# EasyEDA Pro project Debugging_board.eprj

# Schematic Schematic1

## Sheets
1 MC: Board Name: Board1; Create Date: 2026-05-04; Page Name: MC; Project Name: Debugging_board; Schematic Name: Schematic1; Update Date: 2026-06-05; Company: EasyEDA.com; Page Size: A4; Version: V1.0
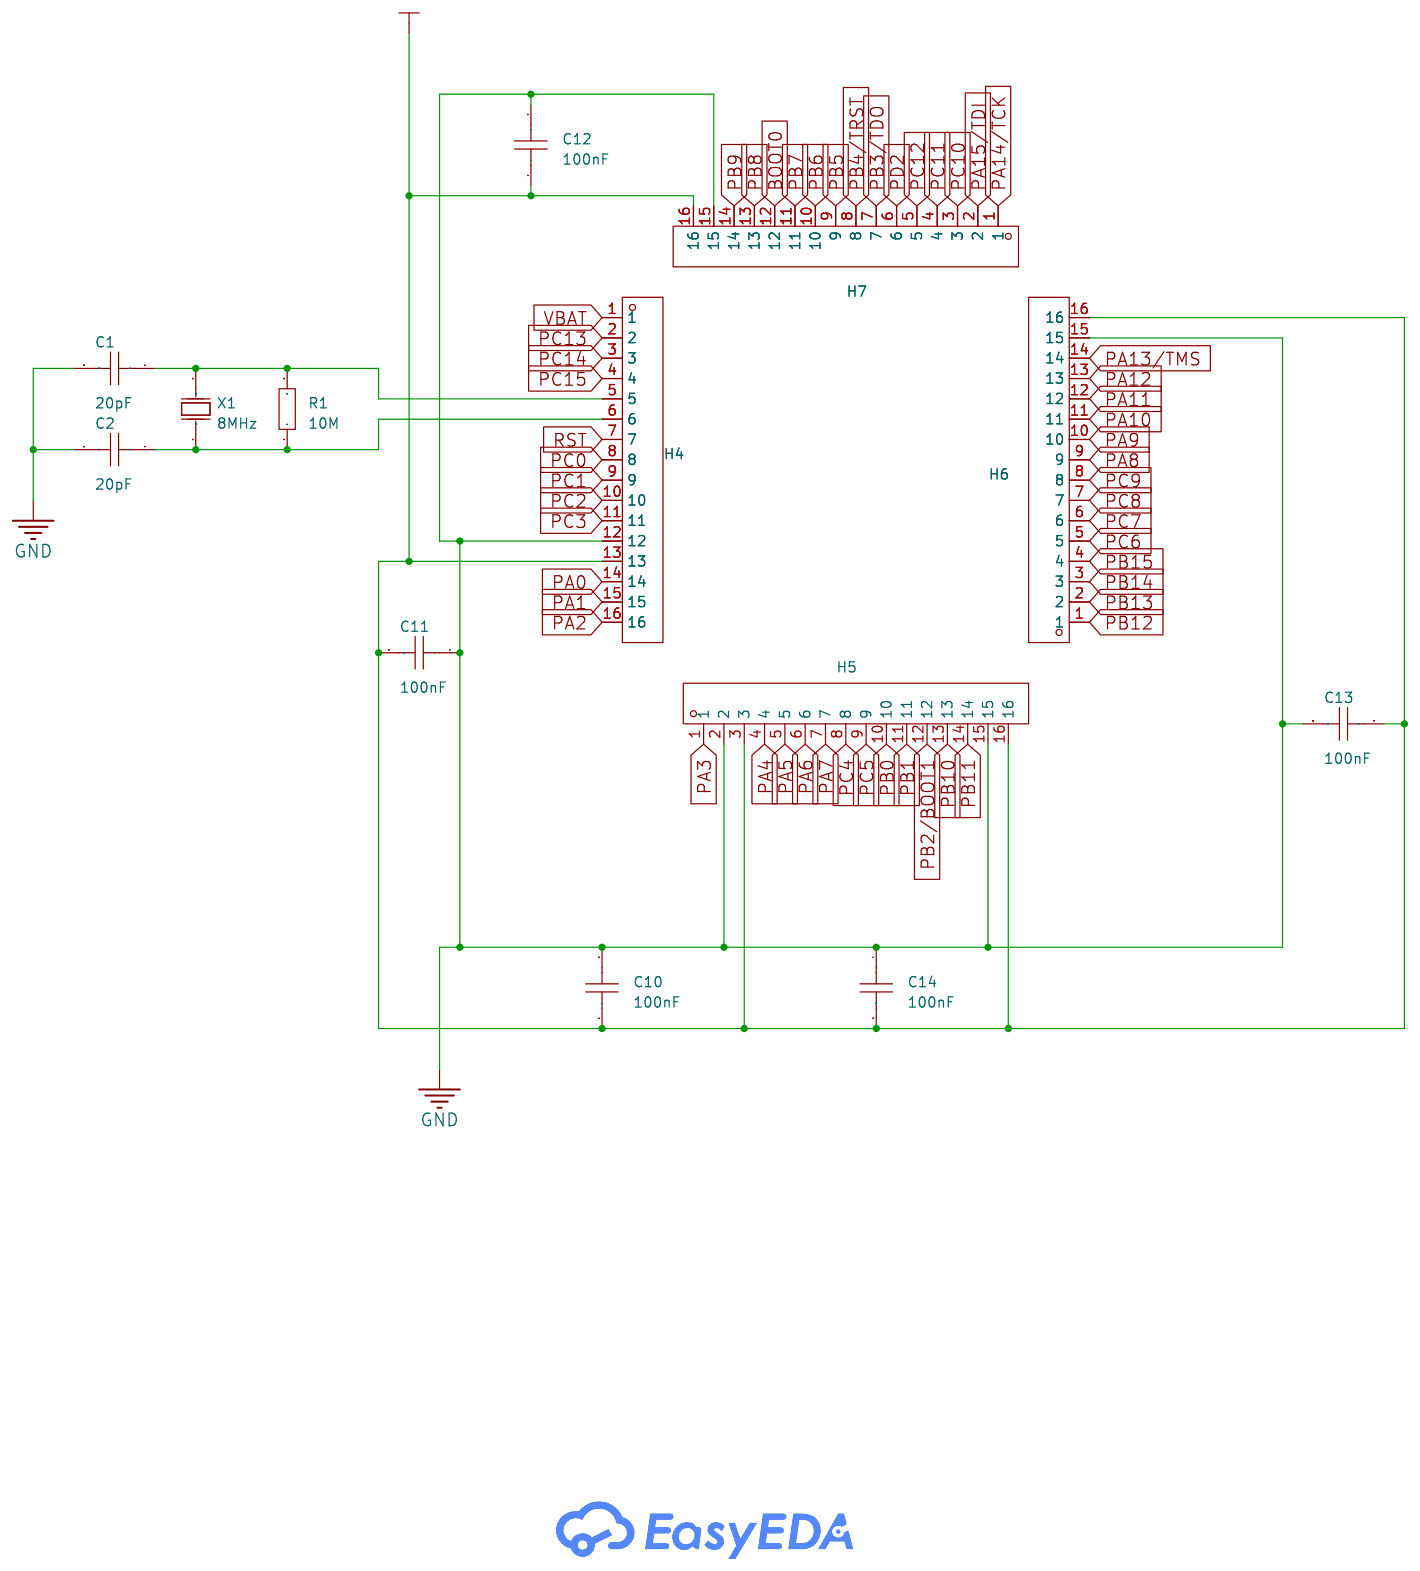
[diagram p0: MC]
2 Power: Page Name: Power; Update Date: 2026-05-11
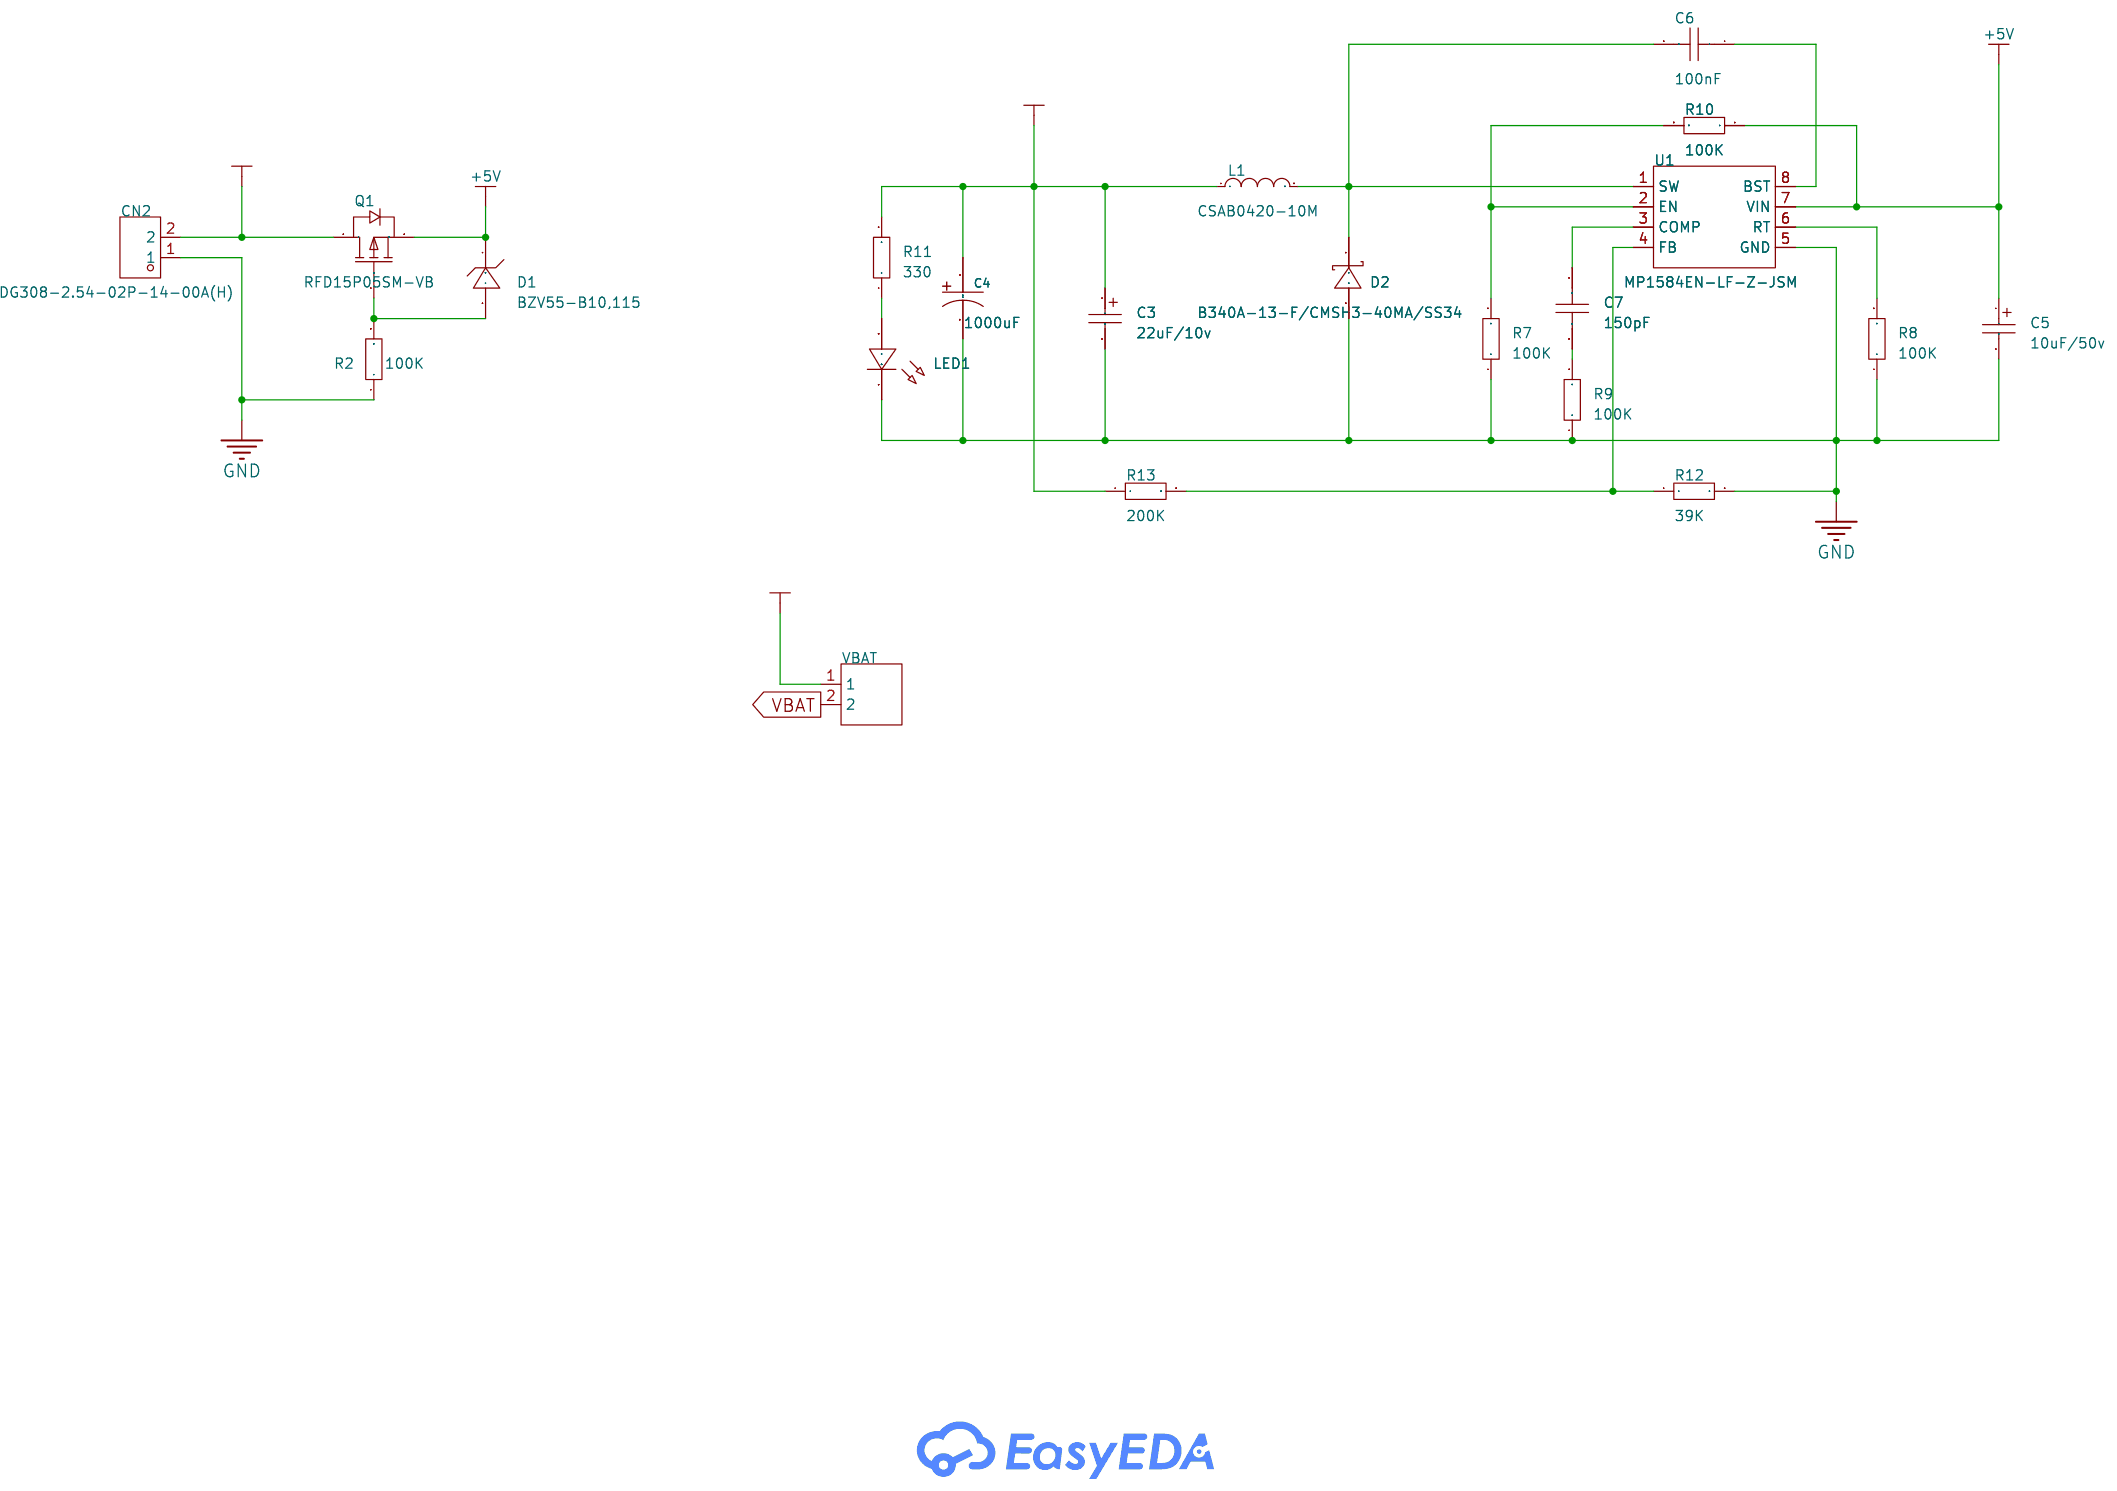
[diagram p1: Power]
3 JTAG/SWD: Page Name: JTAG/SWD; Update Date: 2026-05-11
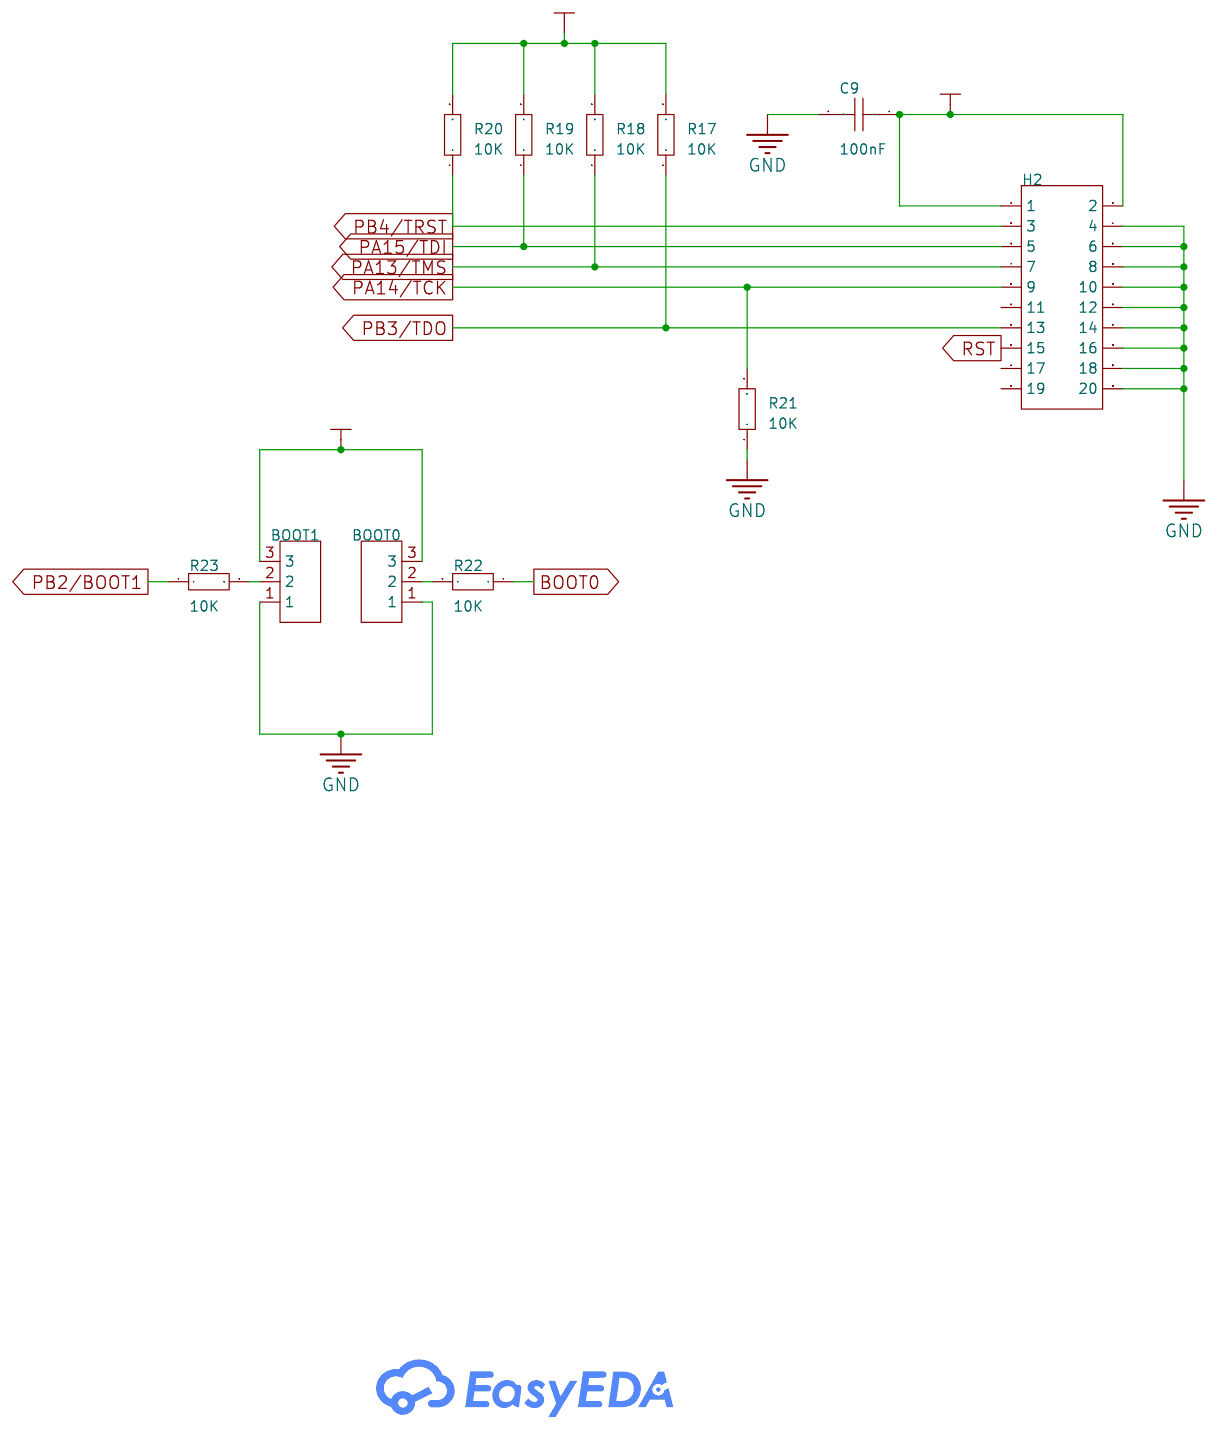
[diagram p2: JTAG/SWD]
4 USB/UART: Page Name: USB/UART; Update Date: 2026-06-09
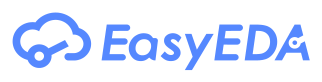
[diagram p3: USB/UART]
5 IN/OUT_Pins: Create Date: 2026-05-11; Page Name: P5
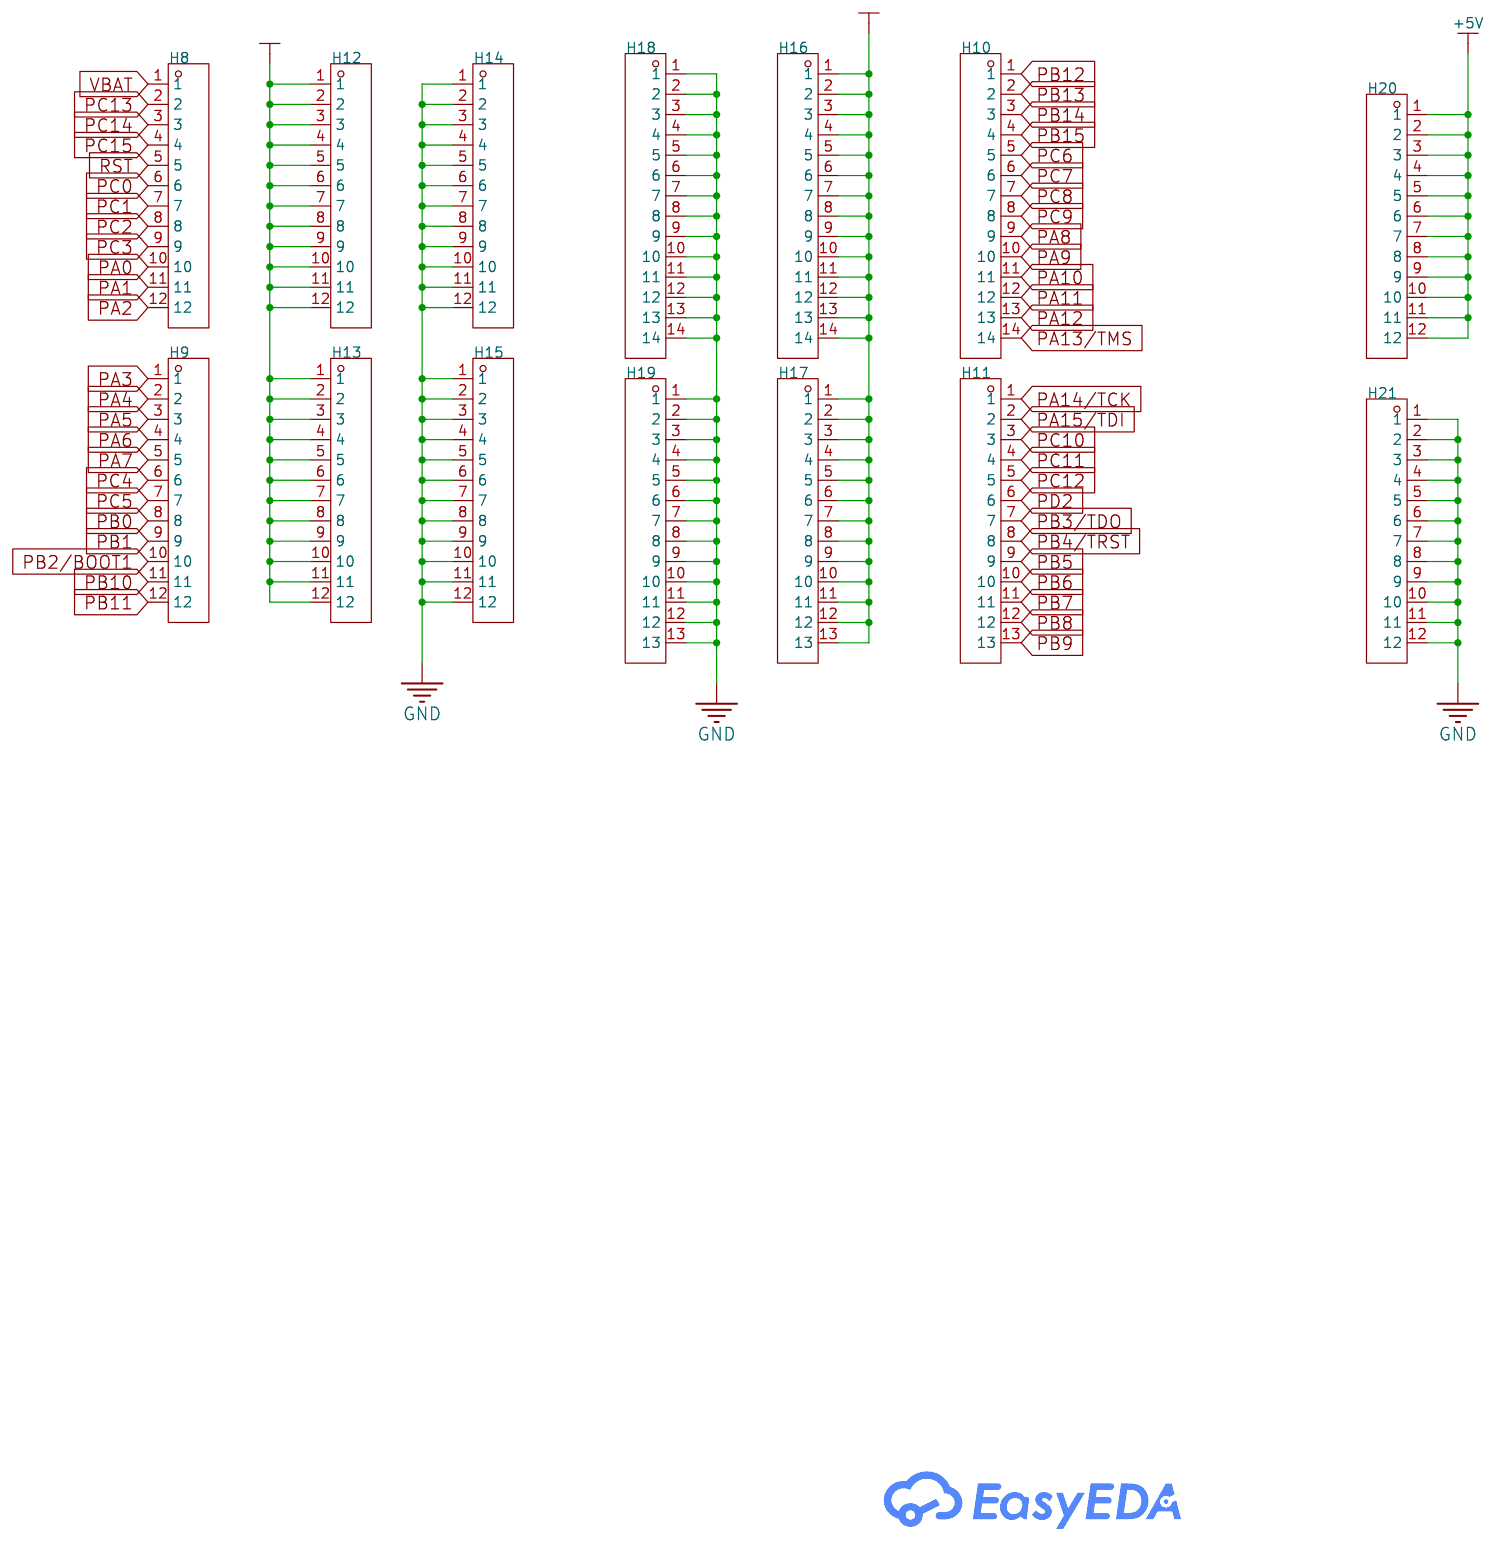
[diagram p4: IN/OUT_Pins]

## Parts
sheet IN/OUT_Pins
H8  -  [HDR-TH_12P-P2.54-V-M]
H9  -  [HDR-TH_12P-P2.54-V-M]
H10  -  [HDR-TH_14P-P2.54-V-M]
H11  -  [HDR-TH_13P-P2.54-V-M]
H12  -  [HDR-TH_12P-P2.54-V-M]
H13  -  [HDR-TH_12P-P2.54-V-M]
H14  -  [HDR-TH_12P-P2.54-V-M]
H15  -  [HDR-TH_12P-P2.54-V-M]
H16  -  [HDR-TH_14P-P2.54-V-M]
H17  -  [HDR-TH_13P-P2.54-V-M]
H18  -  [HDR-TH_14P-P2.54-V-M]
H19  -  [HDR-TH_13P-P2.54-V-M]
H20  -  [HDR-TH_12P-P2.54-V-M]
H21  -  [HDR-TH_12P-P2.54-V-M]
sheet JTAG/SWD
BOOT0  -  [HDR-TH_3P-P2.54-V-M]
BOOT1  -  [HDR-TH_3P-P2.54-V-M]
C9  100nF  [C0603]
H2  -  [HDR-TH_20P-P2.54-V-R2-C10-S2.54]
R17  10K  [R0603]
R18  10K  [R0603]
R19  10K  [R0603]
R20  10K  [R0603]
R21  10K  [R0603]
R22  10K  [R0603]
R23  10K  [R0603]
sheet MC
C1  20pF  [C0603]
C2  20pF  [C0603]
C10  100nF  [C0603]
C11  100nF  [C0603]
C12  100nF  [C0603]
C13  100nF  [C0603]
C14  100nF  [C0603]
H4  -  [HDR-TH_16P-P2.54-V-M]
H5  -  [HDR-TH_16P-P2.54-V-M]
H6  -  [HDR-TH_16P-P2.54-V-M]
H7  -  [HDR-TH_16P-P2.54-V-M]
R1  10M  [R0603]
X1  8MHz  [HC-49S_L11.4-W4.8]
sheet Power
C3  22uF/10v  [CAP-SMD_L7.3-W4.3-R-RD]
C4  1000uF  [CAP-SMD_BD10.0-L10.3-W10.3-LS11.0-FD]
C5  10uF/50v  [CAP-SMD_L7.3-W4.3-R-RD]
C6  100nF  [C0603]
C7  150pF  [C0603]
CN2  DG308-2.54-02P-14-00A(H)  [CONN-TH_DG308-2.54-02P-14-00A]
D1  BZV55-B10,115  [SOD-80C_L3.3-W1.5-RD]
D2  B340A-13-F/CMSH3-40MA/SS34  [SMA_L4.4-W2.6-LS5.0-RD]
L1  CSAB0420-10M  [IND-SMD_L4.4-W4.2]
LED1  -  [LED0805-RD_GREEN]
Q1  RFD15P05SM-VB  [TO-252-2_L6.6-W6.1-P4.58-LS9.9-TL]
R2  100K  [R0603]
R7  100K  [R0603]
R8  100K  [R0603]
R9  100K  [R0603]
R10  100K  [R0603]
R11  330  [R0603]
R12  39K  [R0603]
R13  200K  [R0603]
U1  MP1584EN-LF-Z-JSM  [SOP-8_L4.9-W3.9-P1.27-LS6.0-BL_1]
VBAT  -  [HDR-TH_2P-P2.54-V-M-1]

## Library data of the parts
H8 H9 H12-H15 H20 H21 = HDR-M_2.54_1x12P: Supplier Footprint: Through
H10 H16 H18 = HDR-M_2.54_1x14P: Supplier Footprint: Through
H11 H17 H19 = HDR-M_2.54_1x13P: Supplier Footprint: Through
BOOT0 BOOT1 = HDR-M_2.54_1x3P: Supplier Footprint: Through
C1 C2 C6 C7 C9-C14 = CAP_0603: Supplier Footprint: 0603
H2 = HDR-F_2.54_2x10: Supplier Footprint: Through
R1 R2 R7-R13 R17-R23 = Res_0603: Supplier Footprint: 0603
H4-H7 = HDR-M_2.54_1x16P: Supplier Footprint: Through
X1 = X49SM8MSD2SI: LCSC Part Name: HC-49SMD 8MHZ 20PF ±20PPM -40~85℃ (±30PPM); Supplier Part: C106809; Manufacturer: YXC(扬兴晶振); Supplier Footprint: HC-49S-SMD; JLCPCB Part Class: Extended Part; Datasheet: https://item.szlcsc.com/datasheet/X49SM8MSD2SI/108025.html; Supplier: LCSC; Type: Crystal Oscillator; Normal temperature Frequency Tolerance: ±20ppm; Load Capacitance: 20pF; Frequency Stability: ±30ppm; Equivalent Series Resistance(ESR): 60Ω; Operating Temperature: -40℃~+85℃
C3 C5 = T491D106K050AT: Capacitance:10uF Tolerance:±10% Tolerance:±10% Voltage Rating:50V Equivalent Series Resistance(ESR):800mΩ@100kHz Operating Temperature:-55℃~+125℃ Operating Temperature:-55℃~+125℃; LCSC Part Name: 10uF ±10% 50V; Supplier Part: C117038; Manufacturer: KEMET(基美); Supplier Footprint: CASE-D-7343; JLCPCB Part Class: Extended Part; Datasheet: https://item.szlcsc.com/datasheet/T491D106K050AT/118296.html; Supplier: LCSC; Tolerance: ±10%; Voltage Rating: 50V; Equivalent Series Resistance(ESR): 800mΩ@100kHz; Operating Temperature: -55℃~+125℃
C4 = VT1C102MG105000CE0: Capacitance:1000uF Tolerance:±20% Tolerance:±20% Voltage Rating:16V Ripple Current:- Equivalent Series Resistance(ESR):- Diameter:10mm Height - Seated (Max):10.5mm Lifetime:1000hrs@105℃ Operating Temperature:-40℃~+105℃ Operating Temperature:-40℃~+105℃; LCSC Part Name: 1000uF ±20% 16V; Supplier Part: C189257; Manufacturer: HUAWEI(华威集团); Supplier Footprint: SMD,D10xL10.5mm; JLCPCB Part Class: Extended Part; Datasheet: https://item.szlcsc.com/datasheet/VT1C102MG105000CE0/200665.html; Supplier: LCSC; Tolerance: ±20%; Voltage Rating: 16V; Diameter: 10mm; Height - Seated (Max): 10.5mm; Lifetime: 1000hrs@105℃; Operating Temperature: -40℃~+105℃
CN2 = DG308-2.54-02P-14-00A(H): Number of Positions or Pins:1x2P Pitch:2.54mm Color:Green Mounting Type:Through Hole Number of Pins:2P Number of Rows:1 Number of PINs Per Row:2 Current Rating:8A Voltage Rating (Max):130V Wire Gauge - AWG:18~26 Wire Gauge - mm2:0.5~1 Wire Gauge - mm2:0.5; LCSC Part Name: 1x2P 2.54mm 直插 排数:1 每排P数:2; Supplier Part: C699496; Manufacturer: DEGSON(高正/高松); Supplier Footprint: 插件,P=2.54mm; JLCPCB Part Class: Extended Part; Datasheet: https://item.szlcsc.com/datasheet/DG308-2.54-02P-14-00A(H)/734134.html; Supplier: LCSC; Number of Positions or Pins: 1x2P; Pitch: 2.54mm; Color: Green; Mounting Type: Through Hole; Number of Pins: 2P; Number of Rows: 1; Number of PINs Per Row: 2; Current Rating: 8A; Voltage Rating (Max): 130V; Wire Gauge - AWG: 18~26; Wire Gauge - mm2: 0.5~1; Operating Temperature: -40℃~+105℃
D1 = BZV55-B10,115: Diode Configuration:Independent Zener Voltage(Nom):10V Reverse Leakage Current (Ir):200nA@7V Zener Voltage(Range):9.8V~10.2V Zener Voltage(Range):9.8V~10.2V Pd - Power Dissipation:400mW Impedance(Zzt):20Ω Operating Junction Temperature Range:-65℃~+200℃ Op; LCSC Part Name: 稳压二极管; Supplier Part: C426806; Manufacturer: Nexperia(安世); Supplier Footprint: SOD-80C; JLCPCB Part Class: Extended Part; Datasheet: https://item.szlcsc.com/datasheet/BZV55-B10%252C115/420825.html; Supplier: LCSC; Diode Configuration: Independent; Zener Voltage(Nom): 10V; Reverse Leakage Current (Ir): 200nA@7V; Zener Voltage(Range): 9.8V~10.2V; Pd - Power Dissipation: 400mW; Impedance(Zzt): 20Ω; Operating Junction Temperature Range: -65℃~+200℃
D2 = B340A-13-F: Voltage - Forward(Vf@If):500mV@3A Voltage - DC Reverse(Vr):40V Current - Rectified:3A Reverse Leakage Current (Ir):500uA@40V Operating Junction Temperature Range:-55℃~+150℃ Operating Junction Temperature Range:-55℃~+150℃ Non-Repetitive Peak Forward Surge; LCSC Part Name: 电压:40V 电流:3A; Supplier Part: C85098; Manufacturer: DIODES(美台); Supplier Footprint: SMA(DO-214AC); JLCPCB Part Class: Extended Part; Datasheet: https://item.szlcsc.com/datasheet/B340A-13-F/86270.html; Supplier: LCSC; Voltage - Forward(Vf@If): 500mV@3A; Voltage - DC Reverse(Vr): 40V; Current - Rectified: 3A; Reverse Leakage Current (Ir): 500uA@40V; Operating Junction Temperature Range: -55℃~+150℃; Non-Repetitive Peak Forward Surge Current: 80A
L1 = CSAB0420-100M: Supplier Part: C5125935; Manufacturer: CODACA(科达嘉); JLCPCB Part Class: Extended Part; Datasheet: https://atta.szlcsc.com/upload/public/pdf/source/20230606/07D625B4CCEFD7B1946E8EEA1A450EE5.pdf; Supplier: LCSC
LED1 = LED_0805-B: Supplier Footprint: 0805
Q1 = RFD15P05SM-VB: Number:1 P-Channel Drain to Source Voltage:60V Current - Continuous Drain(Id):30A RDS(on):61mΩ@10V；72mΩ@4.5V Pd - Power Dissipation:- Gate Threshold Voltage (Vgs(th)):2V@250uA Gate Charge(Qg):10nC@10V Input Capacitance(Ciss):1nF Reverse Transfer Capacitan; LCSC Part Name: 1个P沟道 耐压:60V 电流:30A; Supplier Part: C710052; Manufacturer: VBsemi(微碧半导体); Supplier Footprint: TO-252; JLCPCB Part Class: Extended Part; Datasheet: https://item.szlcsc.com/datasheet/RFD15P05SM-VB/748010.html; Supplier: LCSC; Number: 1 P-Channel; Drain to Source Voltage: 60V; Current - Continuous Drain(Id): 30A; RDS(on): 61mΩ@10V；72mΩ@4.5V; Gate Threshold Voltage (Vgs(th)): 2V@250uA; Gate Charge(Qg): 10nC@10V; Input Capacitance(Ciss): 1nF; Reverse Transfer Capacitance (Crss@Vds): 100pF; Operating Temperature: -55℃~+175℃; Type: P-Channel; Output Capacitance(Coss): 120pF
U1 = MP1584EN-LF-Z-JSM: Supplier Part: C49367328; Manufacturer: JSMSEMI(杰盛微); JLCPCB Part Class: Extended Part; Datasheet: https://item.szlcsc.com/datasheet/MP1584EN-LF-Z-JSM/51875040.html; Supplier: LCSC
VBAT = HDR-M_2.54_1x2P: Supplier Footprint: Through

## Nets
+3V3: BOOT0.3 BOOT1.3 C3.1 C4.1 C9.1 C10.1 C11.2 C12.1 C13.1 C14.2 H2.1 H2.2 H4.13 H5.3 H5.16 H6.16 H7.16 H12.1 H12.2 H12.3 H12.4 H12.5 H12.6 H12.7 H12.8 H12.9 H12.10 H12.11 H12.12 H13.1 H13.2 H13.3 H13.4 H13.5 H13.6 H13.7 H13.8 H13.9 H13.10 H13.11 H13.12 H16.1 H16.2 H16.3 H16.4 H16.5 H16.6 H16.7 H16.8 H16.9 H16.10 H16.11 H16.12 H16.13 H16.14 H17.1 H17.2 H17.3 H17.4 H17.5 H17.6 H17.7 H17.8 H17.9 H17.10 H17.11 H17.12 H17.13 L1.1 R11.2 R13.1 R17.2 R18.2 R19.2 R20.2 VBAT.1
+5V: C5.1 D1.1(C) H20.1 H20.2 H20.3 H20.4 H20.5 H20.6 H20.7 H20.8 H20.9 H20.10 H20.11 H20.12 Q1.3(S) R10.1 U1.7(VIN)
+12V: CN2.2 Q1.2(D)
GND: BOOT0.1 BOOT1.1 C1.2 C2.2 C3.2 C4.2 C5.2 C9.2 C10.2 C11.1 C12.2 C13.2 C14.1 CN2.1 D2.2(A) H2.4 H2.6 H2.8 H2.10 H2.12 H2.14 H2.16 H2.18 H2.20 H4.12 H5.2 H5.15 H6.15 H7.15 H14.1 H14.2 H14.3 H14.4 H14.5 H14.6 H14.7 H14.8 H14.9 H14.10 H14.11 H14.12 H15.1 H15.2 H15.3 H15.4 H15.5 H15.6 H15.7 H15.8 H15.9 H15.10 H15.11 H15.12 H18.1 H18.2 H18.3 H18.4 H18.5 H18.6 H18.7 H18.8 H18.9 H18.10 H18.11 H18.12 H18.13 H18.14 H19.1 H19.2 H19.3 H19.4 H19.5 H19.6 H19.7 H19.8 H19.9 H19.10 H19.11 H19.12 H19.13 H21.1 H21.2 H21.3 H21.4 H21.5 H21.6 H21.7 H21.8 H21.9 H21.10 H21.11 H21.12 LED1.1(C) R2.1 R7.1 R8.1 R9.1 R12.2 R21.1 U1.5(GND)
VBAT: H4.1 H8.1 VBAT.2
BOOT0: H7.12 R22.1
PA0: H4.14 H8.10
PA1: H4.15 H8.11
PA2: H4.16 H8.12
PA3: H5.1 H9.1
PA4: H5.4 H9.2
PA5: H5.5 H9.3
PA6: H5.6 H9.4
PA7: H5.7 H9.5
PA8: H6.9 H10.9
PA9: H6.10 H10.10
PA10: H6.11 H10.11
PA11: H6.12 H10.12
PA12: H6.13 H10.13
PA13/TMS: H2.7 H6.14 H10.14 R18.1
PA14/TCK: H2.9 H7.1 H11.1 R21.2
PA15/TDI: H2.5 H7.2 H11.2 R19.1
PB0: H5.10 H9.8
PB1: H5.11 H9.9
PB2/BOOT1: H5.12 H9.10 R23.1
PB3/TDO: H2.13 H7.7 H11.7 R17.1
PB4/TRST: H2.3 H7.8 H11.8 R20.1
PB5: H7.9 H11.9
PB6: H7.10 H11.10
PB7: H7.11 H11.11
PB8: H7.13 H11.12
PB9: H7.14 H11.13
PB10: H5.13 H9.11
PB11: H5.14 H9.12
PB12: H6.1 H10.1
PB13: H6.2 H10.2
PB14: H6.3 H10.3
PB15: H6.4 H10.4
PC0: H4.8 H8.6
PC1: H4.9 H8.7
PC2: H4.10 H8.8
PC3: H4.11 H8.9
PC4: H5.8 H9.6
PC5: H5.9 H9.7
PC6: H6.5 H10.5
PC7: H6.6 H10.6
PC8: H6.7 H10.7
PC9: H6.8 H10.8
PC10: H7.3 H11.3
PC11: H7.4 H11.4
PC12: H7.5 H11.5
PC13: H4.2 H8.2
PC14: H4.3 H8.3
PC15: H4.4 H8.4
PD2: H7.6 H11.6
RST: H2.15 H4.7 H8.5
$1N1019: C1.1 H4.5 R1.2 X1.2(OSC2)
$1N1024: C2.1 H4.6 R1.1 X1.1(OSC1)
$2N251: D1.2(A) Q1.1(G) R2.2
$2N756: C6.2 D2.1(K) L1.2 U1.1(SW)
$2N758: R7.2 R10.2 U1.2(EN)
$2N759: R8.2 U1.6(RT)
$2N760: C7.1 U1.3(COMP)
$2N761: C7.2 R9.2
$2N764: LED1.2(A) R11.1
$2N765: R12.1 R13.2 U1.4(FB)
$2N766: C6.1 U1.8(BST)
$3N561: BOOT0.2 R22.2
$3N565: BOOT1.2 R23.2

Not connected (* = marked no-connect by the designer): H2 11 17 19

# Board PCB1
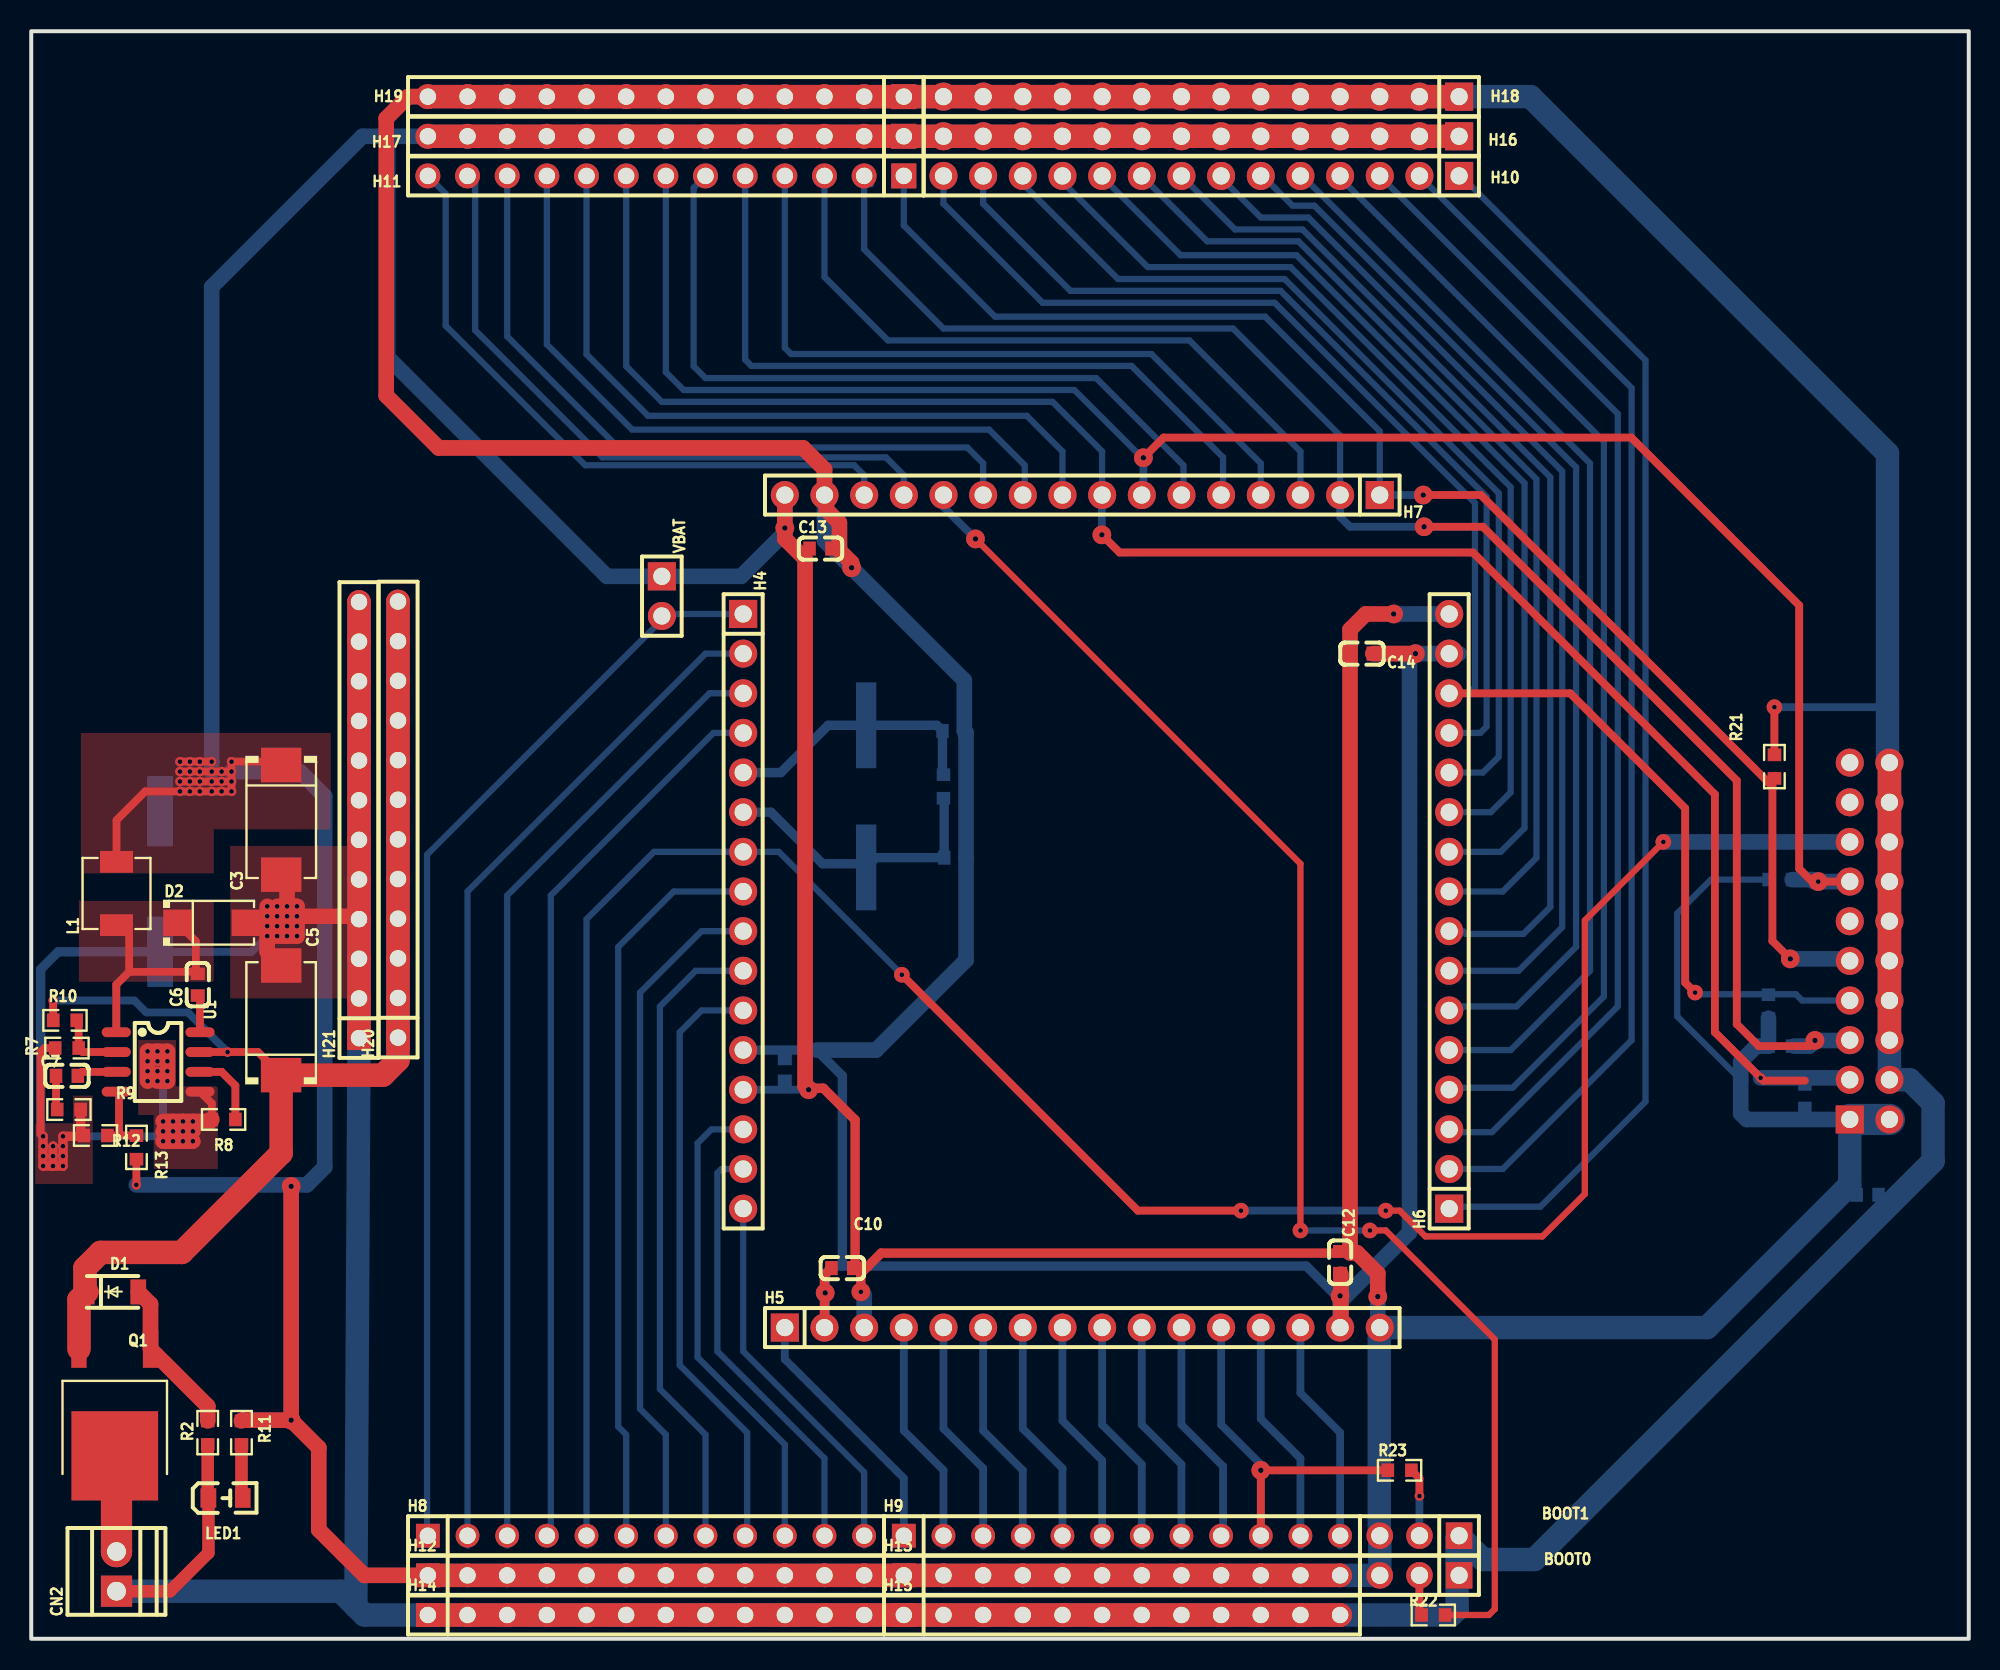
[diagram p5: board, top side]
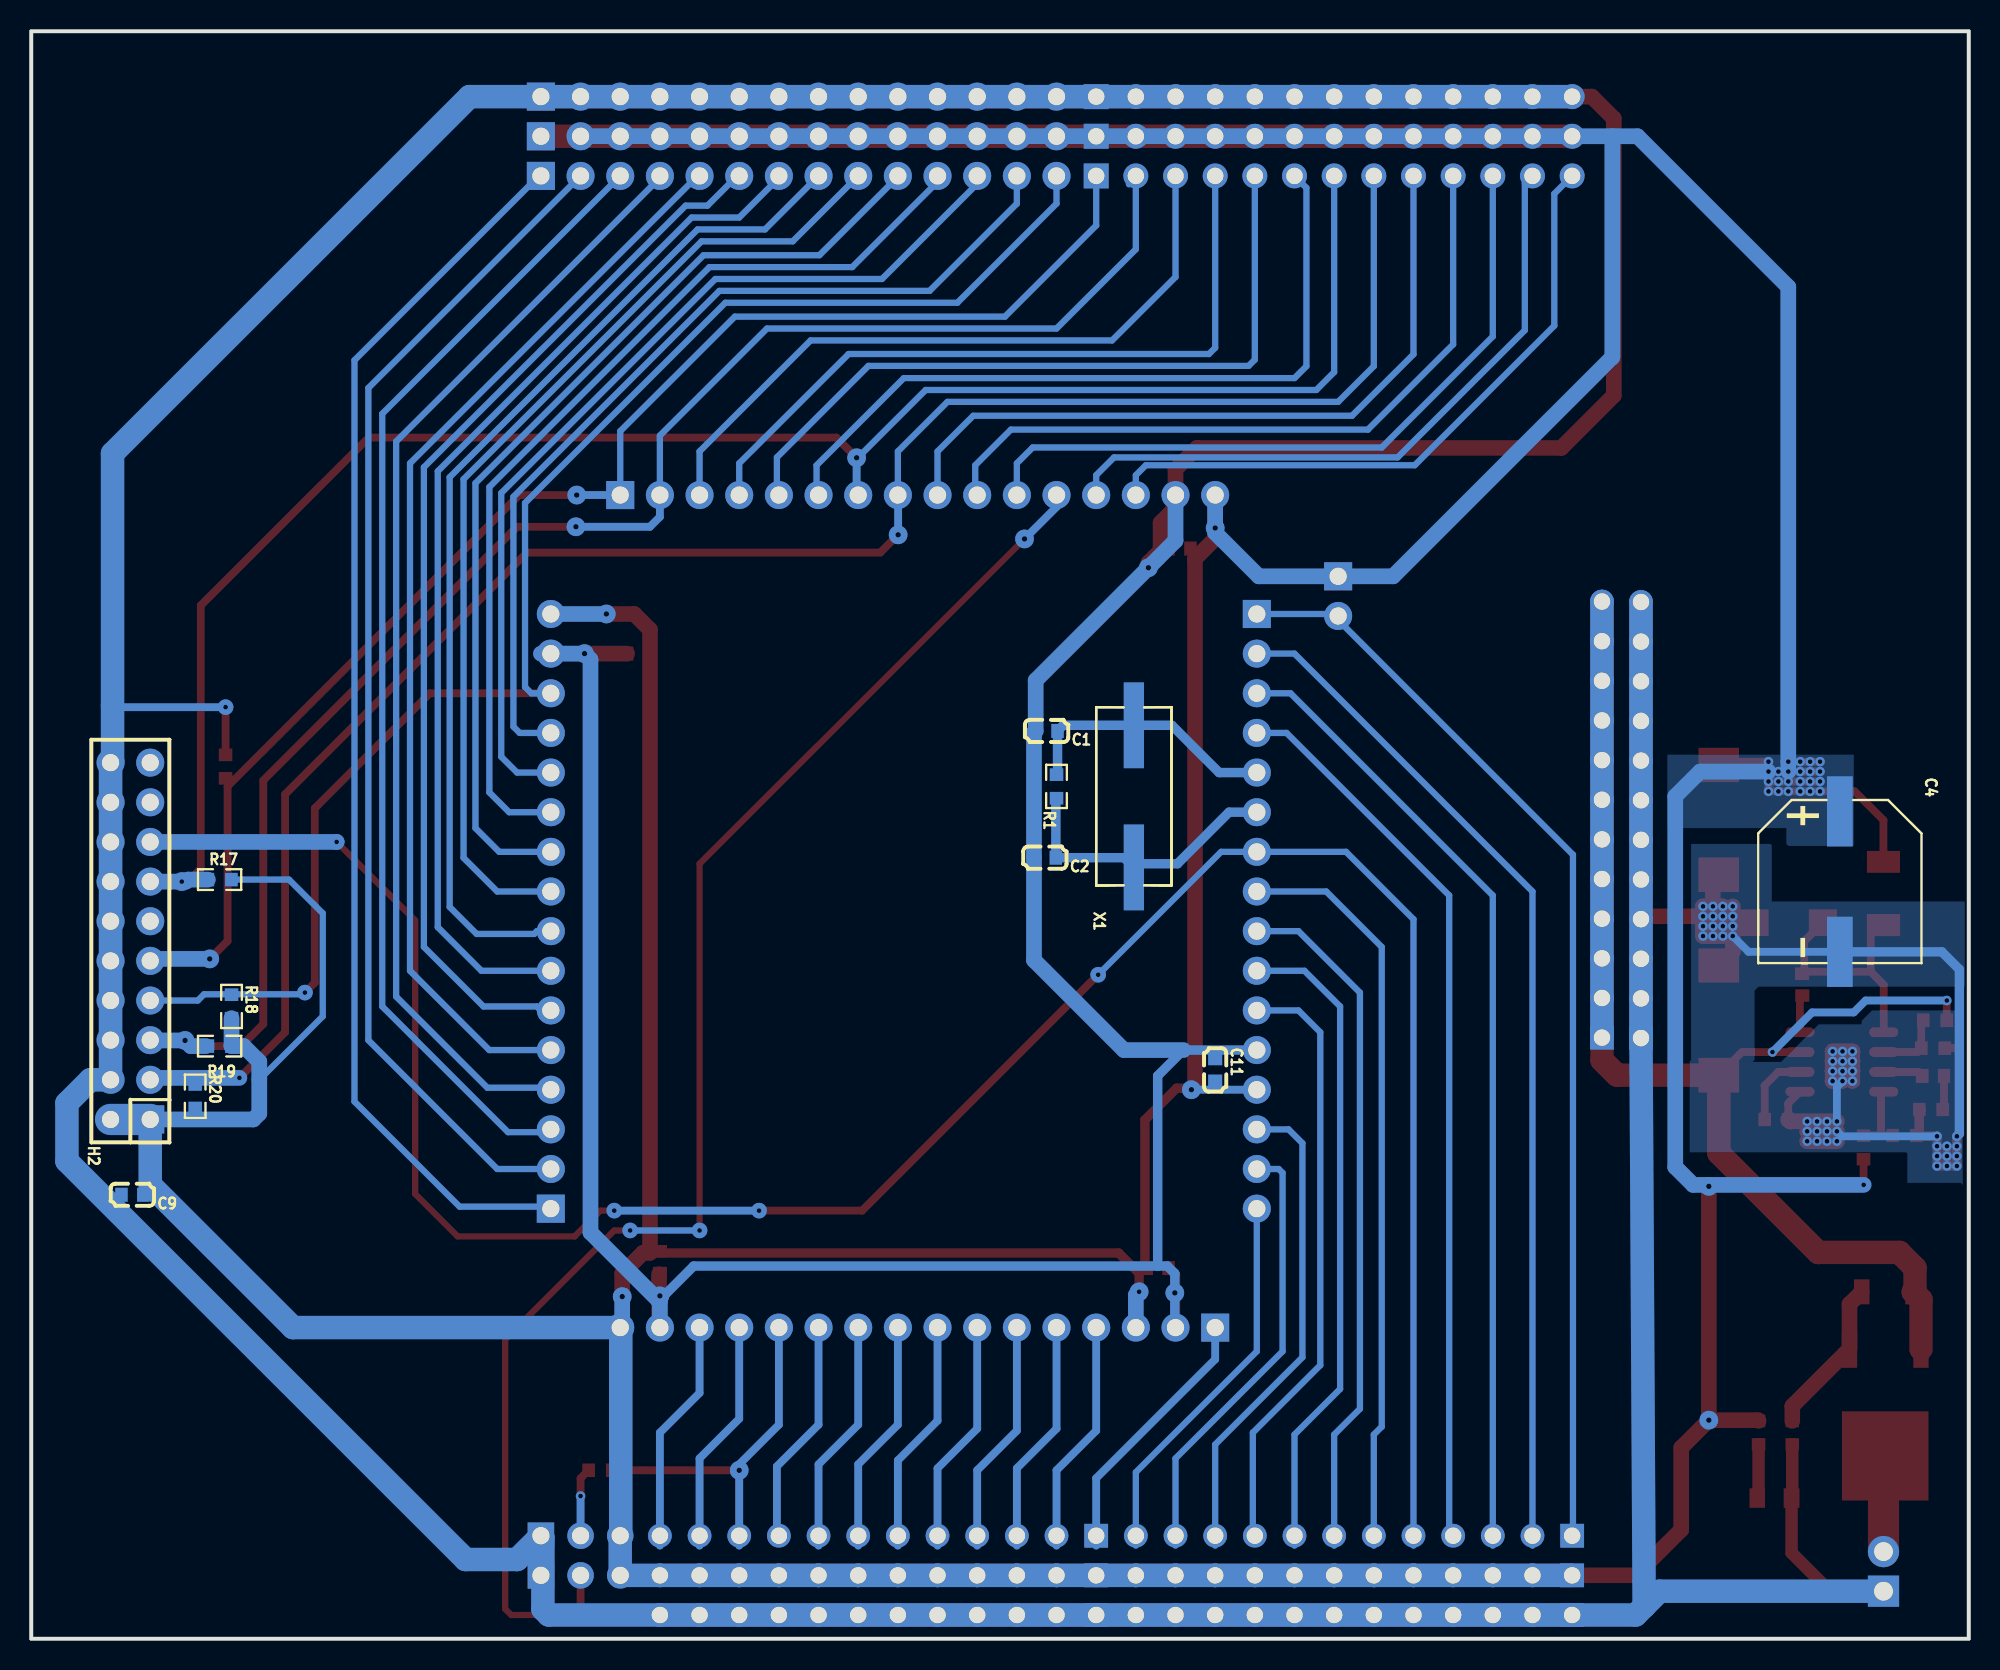
[diagram p6: board, bottom side, seen from below]

Outline 124.08 x 103 mm; copper layers: Top Layer, Bottom Layer. Coordinates in mm from the lower left corner of the outline.
Outline path: rectangle 0,103 124.08,0
Stack: Top Layer 0.035mm / Dielectric1 1.51mm FR4 er 4.5 / Bottom Layer 0.035mm

## Design rules (mm)
template: JLCPCB Capability(Two Layers Board)
spacing copperThickness1oz (default): track to track 0.102, other pairs 0.152 to 0.3
spacing copperThickness2oz: track to track 0.203, other pairs 0.152 to 0.3
track width copperThickness1oz (default): min 0.127, default 0.254, max 2.54
track width copperThickness2oz: min 0.203, default 0.254, max 2.54
differential pair differentialPair (default): width min 0.127, default 0.254, max 2.54; gap min 0.152, default 0.152
via viaSize (default): diameter min 0.5, default 0.61, max 10; hole min 0.3, default 0.305, max 6.3

## Placement (name value [footprint] x y rotation side)
BOOT0  -  [HDR-TH_3P-P2.54-V-M]  88.9 4.06 180 top
BOOT1  -  [HDR-TH_3P-P2.54-V-M]  88.9 6.6 180 top
C1  20pF  [C0603]  59.06 58.17 0 bottom
C2  20pF  [C0603]  59.16 50.05 0 bottom
C3  22uF/10v  [CAP-SMD_L7.3-W4.3-R-RD]  16.01 52.47 90 top
C4  1000uF  [CAP-SMD_BD10.0-L10.3-W10.3-LS11.0-FD]  8.25 48.51 270 bottom
C5  10uF/50v  [CAP-SMD_L7.3-W4.3-R-RD]  16 39.62 270 top
C6  100nF  [C0603]  10.67 41.91 90 top
C7  150pF  [C0603]  2.29 36.07 180 top
C9  100nF  [C0603]  117.6 28.45 0 bottom
C10  100nF  [C0603]  51.94 23.75 180 top
C11  100nF  [C0603]  48.26 36.45 270 bottom
C12  100nF  [C0603]  83.82 24.13 270 top
C13  100nF  [C0603]  50.55 69.85 0 top
C14  100nF  [C0603]  85.22 63.12 180 top
CN2  DG308-2.54-02P-14-00A(H)  [CONN-TH_DG308-2.54-02P-14-00A]  5.46 4.32 90 top
D1  BZV55-B10,115  [SOD-80C_L3.3-W1.5-RD]  5.21 22.22 0 top
D2  B340A-13-F/CMSH3-40MA/SS34  [SMA_L4.4-W2.6-LS5.0-RD]  11.54 45.88 0 top
H2  -  [HDR-TH_20P-P2.54-V-R2-C10-S2.54]  117.73 44.7 90 bottom
H4  -  [HDR-TH_16P-P2.54-V-M]  45.59 46.61 270 top
H5  -  [HDR-TH_16P-P2.54-V-M]  67.31 19.94 0 top
H6  -  [HDR-TH_16P-P2.54-V-M]  90.81 46.61 90 top
H7  -  [HDR-TH_16P-P2.54-V-M]  67.31 73.28 180 top
H8  -  [HDR-TH_12P-P2.54-V-M]  39.37 6.6 0 top
H9  -  [HDR-TH_12P-P2.54-V-M]  69.85 6.6 0 top
H10  -  [HDR-TH_14P-P2.54-V-M]  74.93 93.73 180 top
H11  -  [HDR-TH_13P-P2.54-V-M]  40.64 93.73 180 top
H12  -  [HDR-TH_12P-P2.54-V-M]  39.37 4.06 0 top
H13  -  [HDR-TH_12P-P2.54-V-M]  69.85 4.06 0 top
H14  -  [HDR-TH_12P-P2.54-V-M]  39.37 1.52 0 top
H15  -  [HDR-TH_12P-P2.54-V-M]  69.85 1.52 0 top
H16  -  [HDR-TH_14P-P2.54-V-M]  74.93 96.27 180 top
H17  -  [HDR-TH_13P-P2.54-V-M]  40.64 96.27 180 top
H18  -  [HDR-TH_14P-P2.54-V-M]  74.93 98.81 180 top
H19  -  [HDR-TH_13P-P2.54-V-M]  40.64 98.81 180 top
H20  -  [HDR-TH_12P-P2.54-V-M]  23.49 52.49 90 top
H21  -  [HDR-TH_12P-P2.54-V-M]  20.99 52.46 90 top
L1  CSAB0420-10M  [IND-SMD_L4.4-W4.2]  5.46 47.75 90 top
LED1  -  [LED0805-RD_GREEN]  12.45 9.02 0 top
Q1  RFD15P05SM-VB  [TO-252-2_L6.6-W6.1-P4.58-LS9.9-TL]  5.35 15.14 270 top
R1  10M  [R0603]  58.42 54.61 90 bottom
R2  100K  [R0603]  11.3 13.21 90 top
R7  100K  [R0603]  2.29 37.85 0 top
R8  100K  [R0603]  12.32 33.27 0 top
R9  100K  [R0603]  2.41 33.91 180 top
R10  100K  [R0603]  2.16 39.62 0 top
R11  330  [R0603]  13.46 13.21 90 top
R12  39K  [R0603]  4.12 32.25 180 top
R13  200K  [R0603]  6.74 31.48 90 top
R17  10K  [R0603]  112.01 48.64 180 bottom
R18  10K  [R0603]  111.25 40.51 270 bottom
R19  10K  [R0603]  112.01 37.97 180 bottom
R20  10K  [R0603]  113.58 34.76 270 bottom
R21  10K  [R0603]  111.63 55.88 270 top
R22  10K  [R0603]  89.79 1.52 180 top
R23  10K  [R0603]  87.63 10.79 0 top
U1  MP1584EN-LF-Z-JSM  [SOP-8_L4.9-W3.9-P1.27-LS6.0-BL_1]  8.13 36.96 270 top
VBAT  -  [HDR-TH_2P-P2.54-V-M-1]  40.39 66.8 270 top
X1  8MHz  [HC-49S_L11.4-W4.8]  53.47 53.97 90 bottom

## Footprints (pads in the part's own frame, mm; a bottom-side part is the same pattern mirrored in y, then rotated)
C0603
  rect 0.8x0.9 smd: 1(-0.7,0) 2(0.7,0)
CAP-SMD_BD10.0-L10.3-W10.3-LS11.0-FD
  rect 4.5x1.65 smd: 1(-4.5,0) 2(4.5,0)
CAP-SMD_L7.3-W4.3-R-RD
  rect 2.208x2.592 smd: 1(3.511,0) 2(-3.511,0)
CONN-TH_DG308-2.54-02P-14-00A
  rect 2x2 hole 1.2x1: 1(-1.27,0)
  round 2 hole 1.2x1: 2(1.27,0)
HC-49S_L11.4-W4.8
  rect 5.5x1.3 smd: 1(-4.553,0) 2(4.553,0)
HDR-TH_2P-P2.54-V-M-1
  rect 1.8x1.8 hole 1.1: 1(-1.27,0)
  round 1.8 hole 1.1: 2(1.27,0)
HDR-TH_3P-P2.54-V-M
  rect 1.7x1.7 hole 1.1: 1(-2.54,0)
  round 1.7 hole 1.1: 2(0,0) 3(2.54,0)
HDR-TH_12P-P2.54-V-M
  rect 1.524x1.524 hole 1.05: 1(-13.97,0)
  round 1.524 hole 1.05: 2(-11.43,0) 3(-8.89,0) 4(-6.35,0) 5(-3.81,0) 6(-1.27,0) 7(1.27,0) 8(3.81,0) 9(6.35,0) 10(8.89,0) 11(11.43,0) 12(13.97,0)
HDR-TH_13P-P2.54-V-M
  rect 1.6x1.6 hole 1.05: 1(-15.24,0)
  round 1.6 hole 1.05: 2(-12.7,0) 3(-10.16,0) 4(-7.62,0) 5(-5.08,0) 6(-2.54,0) 7(0,0) 8(2.54,0) 9(5.08,0) 10(7.62,0) 11(10.16,0) 12(12.7,0) 13(15.24,0)
HDR-TH_14P-P2.54-V-M
  rect 1.8x1.8 hole 1.1: 1(-16.51,0)
  round 1.8 hole 1.1: 2(-13.97,0) 3(-11.43,0) 4(-8.89,0) 5(-6.35,0) 6(-3.81,0) 7(-1.27,0) 8(1.27,0) 9(3.81,0) 10(6.35,0) 11(8.89,0) 12(11.43,0) 13(13.97,0) 14(16.51,0)
HDR-TH_16P-P2.54-V-M
  rect 1.8x1.8 hole 1.1: 1(-19.05,0)
  round 1.8 hole 1.1: 2(-16.51,0) 3(-13.97,0) 4(-11.43,0) 5(-8.89,0) 6(-6.35,0) 7(-3.81,0) 8(-1.27,0) 9(1.27,0) 10(3.81,0) 11(6.35,0) 12(8.89,0) 13(11.43,0) 14(13.97,0) 15(16.51,0) 16(19.05,0)
HDR-TH_20P-P2.54-V-R2-C10-S2.54
  rect 1.8x1.8 hole 1.1x0.9: 1(-11.43,-1.27)
  round 1.8 hole 1.1x0.9: 2(-11.43,1.27) 3(-8.89,-1.27) 4(-8.89,1.27) 5(-6.35,-1.27) 6(-6.35,1.27) 7(-3.81,-1.27) 8(-3.81,1.27) 9(-1.27,-1.27) 10(-1.27,1.27) 11(1.27,-1.27) 12(1.27,1.27) 13(3.81,-1.27) 14(3.81,1.27) 15(6.35,-1.27) 16(6.35,1.27) 17(8.89,-1.27) 18(8.89,1.27) 19(11.43,-1.27) 20(11.43,1.27)
IND-SMD_L4.4-W4.2
  rect 1.4x2.12 smd: 1(2.028,0) 2(-2.028,0)
LED0805-RD_GREEN
  rect 1x1.25 smd: 1(-1.1,0) 2(1.1,0)
R0603
  rect 0.806x0.864 smd: 1(-0.753,0) 2(0.753,0)
SMA_L4.4-W2.6-LS5.0-RD
  rect 1.8x1.7 smd: 1(-2.192,0) 2(2.192,0)
SOD-80C_L3.3-W1.5-RD
  rect 1x1.6 smd: 1(-1.65,0) 2(1.65,0)
SOP-8_L4.9-W3.9-P1.27-LS6.0-BL_1
  oval 0.63x1.865 smd: 1(-1.905,-2.683) 2(-0.635,-2.683) 3(0.635,-2.683) 4(1.905,-2.683) 5(1.905,2.683) 6(0.635,2.683) 7(-0.635,2.683) 8(-1.905,2.683)
TO-252-2_L6.6-W6.1-P4.58-LS9.9-TL
  rect 2.409x0.979 smd: 1(-3.424,2.29) 3(-3.424,-2.29)
  rect 5.711x5.548 smd: 2(3.424,0)

## Nets
As in the schematic.

Pads without a net: H2 11 17 19

## Via types
v1: diameter 0.61, hole 0.305, Top Layer to Bottom Layer, 79 vias
v2: diameter 1.2, hole 0.35, Top Layer to Bottom Layer, 18 vias
v3: diameter 1, hole 0.305, Top Layer to Bottom Layer, 8 vias
v4: diameter 1.2, hole 0.305, Top Layer to Bottom Layer, 2 vias

## Routing (per net, layer and track width the routed paths; a pad name or vN(x,y) marks a point on that pad's centre or on a via; arc(x,y) is an arc through that point)
+3V3: length 683.9
  Top Layer w0.5: C3.1 15.79,56.2 v1(12.83,56.2) v1(12.83,55.56) ; v1(12.83,55.56) v1(12.83,54.93) ; v1(12.83,55.56) v1(12.19,55.56) v1(11.56,55.56) v1(10.8,55.56) v1(10.16,55.56) v1(9.53,55.56) ; v1(12.83,54.93) v1(12.19,54.93) v1(11.56,54.93) v1(10.8,54.93) v1(10.16,54.93) v1(9.53,54.93) ; v1(12.83,54.93) v1(12.83,54.29) v1(12.19,54.29) v1(11.56,54.29) v1(10.8,54.29) v1(10.16,54.29) v1(9.53,54.29) 7.3,54.29 5.46,52.45 L1.1 ; v1(6.73,29.08) 6.73,30.72 R13.1 ; v1(11.56,56.2) v1(10.8,56.2) v1(10.16,56.2) v1(9.53,56.2)
  Top Layer w0.6: v4(53.13,22.23) 53.13,23.41 53.59,23.88 ; 53.59,23.88 52.96,23.88 52.76,24.07 52.76,33.24 50.73,35.27 49.88,35.27 v2(49.78,35.18) ; 53.59,23.88 54.43,24.71 83.95,24.71
  Top Layer w1: v2(87.25,65.66) 85.46,65.66 84.46,64.66 84.46,24.73 84.91,24.73 86.23,23.4 v2(86.23,21.92) ; H7.16 v2(48.26,71.17) 48.26,70.48 49.56,69.19 49.56,35.41 v2(49.78,35.18) ; v2(16.65,28.99) v2(16.65,14.01) ; v2(16.65,14.01) 18.42,12.24 18.42,6.98 21.34,4.06 H12.1 ; v2(16.65,14.01) 13.51,14.01 R11.2
  Top Layer w1.5: H16.1 H16.2 H16.3 H16.4 H16.5 H16.6 H16.7 H16.8 H16.9 H16.10 H16.11 H16.12 H16.13 H16.14 H17.1 H17.2 H17.3 H17.4 H17.5 H17.6 H17.7 H17.8 H17.9 H17.10 H17.11 H17.12 H17.13 ; H13.12 H13.11 H13.10 H13.9 H13.8 H13.7 H13.6 H13.5 H13.4 H13.3 H13.2 H13.1 H12.12 H12.11 H12.10 H12.9 H12.8 H12.7 H12.6 H12.5 H12.4 H12.3 H12.2 H12.1
  Bottom Layer w0.4: 109.47,35.81 105.41,39.88 105.41,46.48 107.57,48.64 R17.2
  Bottom Layer w0.5: v2(49.78,35.18) H4.13
  Bottom Layer w1: v4(53.13,22.23) 53.34,22.02 H5.3 ; 22.83,96.27 21.21,96.27 11.56,86.61 v1(11.56,56.2) v1(11.56,55.56) ; 22.83,96.27 H17.13 H17.12 H17.11 H17.10 H17.9 H17.8 H17.7 H17.6 H17.5 H17.4 H17.3 H17.2 H17.1 H16.14 H16.13 H16.12 H16.11 H16.10 H16.9 H16.8 H16.7 H16.6 H16.5 H16.4 H16.3 H16.2 ; 22.83,96.27 22.83,82.11 36.86,68.07 VBAT.1 45.47,68.07 48.26,70.87 H7.16 ; v1(6.73,29.08) 17.65,29.08 18.8,30.23 18.8,53.97 17.21,55.56 v1(12.83,55.56) ; R18.2 111.25,37.98 R19.2 ; 111.13,37.97 110.47,37.97 109.47,36.97 109.47,33.65 109.85,33.27 115.95,33.27 ; v2(87.25,65.66) H6.16 ; H5.16 86.23,20.07 v2(86.23,21.92)
  Bottom Layer w1.5: H12.1 H12.2 H12.3 H12.4 H12.5 H12.6 H12.7 H12.8 H12.9 H12.10 H12.11 H12.12 H13.1 H13.2 H13.3 H13.4 H13.5 H13.6 H13.7 H13.8 H13.9 H13.10 H13.11 H13.12 BOOT0.3 BOOT1.3 86.33,6.64 86.33,19.91 H5.16 107.31,19.94 116.46,29.08 116.46,33.27
  Bottom Layer w2: 116.46,33.27 119,33.27
+5V: length 110.9
  Top Layer w0.5: R10.1 v1(1.41,40.89) ; U1.7 v1(12.57,37.59) 14.52,37.59 C5.1
  Top Layer w1.5: H20.12 H20.11 H20.10 H20.9 H20.8 H20.7 H20.6 H20.5 H20.4 H20.3 H20.2 H20.1 23.49,37.08 22.52,36.11 C5.1 16,31.11 9.64,24.75 4.44,24.75 3.44,23.75 3.44,22.34 D1.1 3.06,21.73 3.06,18.57
  Bottom Layer w0.5: v1(12.57,37.59) 10.03,40.13 7.37,40.13 6.6,40.89 v1(1.41,40.89)
  Bottom Layer w1.5: H20.1 H20.2 H20.3 H20.4 H20.5 H20.6 H20.7 H20.8 H20.9 H20.10 H20.11 H20.12
+12V: length 6.2
  Top Layer w2: CN2.2 5.46,11.61 Q1.2
GND: length 844.9
  Top Layer w0.5: R7.1 0.85,37.85 0.6,37.59 0.6,32.36 v1(0.76,32.19) ; R8.1 11.57,34.3 U1.5 ; R21.1 v3(111.63,59.69)
  Top Layer w0.6: 3.04,33.91 3.17,33.78 3.17,32.58 3.37,32.37 3.37,32.25 3.32,32.19 v1(2.03,32.19) v1(2.03,31.56) v1(2.03,30.92) v1(2.03,30.29) v1(1.4,30.29) ; v1(1.4,30.29) v1(0.76,30.29) v1(0.76,30.92) v1(0.76,31.56) v1(0.76,32.19) ; v1(1.4,30.29) v1(1.4,30.92) v1(1.4,31.56) ; 50.8,19.62 50.8,23.31 C10.2
  Top Layer w0.8: 5.46,3.05 8.89,3.05 11.35,5.5 LED1.1 11.3,9.06 R2.1
  Top Layer w1: C14.1 v2(88.65,63.12) ; v1(16.38,46.93) v1(17.02,46.93) v1(17.02,46.29) ; v1(16.38,46.93) v1(15.75,46.93) ; v1(16.38,46.93) 16.38,48.59 C3.2 ; v1(16.38,46.93) v1(16.38,46.29) 15.97,45.88 15.11,45.88 ; H21.4 20.81,46.29 v1(17.02,46.29) ; 15.11,45.88 D2.2 ; 15.11,45.88 v1(15.11,45.66) v1(15.11,45.02) 15.11,44.02 C5.2 ; 15.11,45.88 v1(15.11,46.29) v1(15.11,46.93) ; v1(8.45,33.15) v1(9.08,33.15) v1(9.72,33.15) v1(10.35,33.15) 11.44,33.15 R8.1 ; v1(15.75,45.02) v1(16.38,45.02) v1(17.02,45.02) v1(17.02,45.66) v1(17.02,46.29) ; v1(10.35,31.88) v1(9.72,31.88) v1(9.08,31.88) v1(8.45,31.88) ; v1(8.45,32.51) v1(9.08,32.51) v1(9.72,32.51) v1(10.35,32.51) ; H5.15 83.87,19.99 83.87,23.36 ; v2(52.54,68.62) 52.54,68.94 51.63,69.85 51.75,69.98 51.75,71.5 50.93,72.33 50.93,73.15 H7.15 50.8,74.93 49.43,76.3 26.09,76.3 22.73,79.65 22.73,97.41 24.13,98.81 H19.13 ; v1(8.09,35.73) v1(8.72,35.73) v1(8.72,36.37) v1(8.72,37) v1(8.72,37.64) v1(8.09,37.64) v1(7.45,37.64) v1(7.45,37) v1(7.45,36.37) v1(7.45,35.73)
  Top Layer w1.5: H21.12 H21.11 H21.10 H21.9 H21.8 H21.7 H21.6 H21.5 H21.4 H21.3 H21.2 H21.1 ; 119,38.35 H2.8 H2.10 H2.12 H2.14 H2.16 H2.18 H2.20 ; H14.1 H14.2 H14.3 H14.4 H14.5 H14.6 H14.7 H14.8 H14.9 H14.10 H14.11 H14.12 H15.1 H15.2 H15.3 H15.4 H15.5 H15.6 H15.7 H15.8 H15.9 H15.10 H15.11 H15.12 ; H18.1 H18.2 H18.3 H18.4 H18.5 H18.6 H18.7 H18.8 H18.9 H18.10 H18.11 H18.12 H18.13 H18.14 H19.1 H19.2 H19.3 H19.4 H19.5 H19.6 H19.7 H19.8 H19.9 H19.10 H19.11 H19.12 H19.13
  Bottom Layer w0.5: 118.87,59.8 118.76,59.69 v3(111.63,59.69) ; C4.2 14.11,44.01 v1(15.11,45.02) ; v1(8.45,32.51) 8.13,32.19 v1(2.03,32.19) ; v1(8.45,33.15) 8.45,35.37 v1(8.09,35.73)
  Bottom Layer w0.6: 83.95,21.72 83.82,21.72 81.66,23.88 51.94,23.88 ; H5.2 50.84,19.98 v2(50.84,22.16) 50.84,23.41 51.32,23.88 51.94,23.88 ; 51.94,23.88 51.94,36.07 50.29,37.72 H4.12 ; v1(0.76,32.19) 0.6,32.36 0.6,42.89 1.72,44.01 C4.2
  Bottom Layer w1: 91.44,63.12 v2(88.65,63.12) 88.26,62.74 88.26,26.03 83.82,21.59 83.82,20.54 ; 50.29,37.72 54.1,37.72 59.86,43.48 C2.2 59.86,58.06 C1.2 59.75,61.4 v2(52.54,68.62) 50.8,70.36 H7.15
  Bottom Layer w1.5: 20.79,2.07 21.34,1.52 H14.1 H14.2 H14.3 H14.4 H14.5 H14.6 H14.7 H14.8 H14.9 H14.10 H14.11 H14.12 H15.1 H15.2 H15.3 H15.4 H15.5 H15.6 H15.7 H15.8 H15.9 H15.10 H15.11 H15.12 90.93,1.52 91.31,1.91 91.31,6.48 BOOT1.1 92.96,5.08 96.27,5.08 121.79,30.61 121.79,34.31 120.29,35.81 H2.4 H2.8 H2.10 H2.12 H2.14 H2.16 H2.18 H2.20 118.87,56.26 118.87,75.95 96.01,98.81 H18.1 H18.2 H18.3 H18.4 H18.5 H18.6 H18.7 H18.8 H18.9 H18.10 H18.11 H18.12 H18.13 H18.14 H19.1 H19.2 H19.3 H19.4 H19.5 H19.6 H19.7 H19.8 H19.9 H19.10 H19.11 H19.12 H19.13 ; 20.79,2.07 H21.1 H21.2 H21.3 H21.4 H21.5 H21.6 H21.7 H21.8 H21.9 H21.10 H21.11 H21.12 ; 20.79,2.07 19.81,3.05 5.46,3.05
  vias: v1(8.09,37) v1(8.09,36.37) v1(15.75,46.29) v1(15.75,45.66) v1(16.38,45.66) v2(83.82,21.97)
VBAT: length 71.1
  Bottom Layer w0.4: 25.22,6.15 25.22,6.78 H8.1 ; 40.77,65.66 H4.1 ; 40.77,65.66 25.35,50.24 25.35,6.78 ; 40.77,65.66 40.64,65.66
BOOT0: length 92.5
  Top Layer w0.4: v3(85.72,26.16) 86.74,26.16 93.73,19.18 93.73,1.91 93.34,1.52 R22.1 ; v2(60.47,70.47) 81.28,49.66 v3(81.28,26.16)
  Bottom Layer w0.4: v3(81.28,26.16) v3(85.72,26.16)
  Bottom Layer w0.5: H7.12 58.42,72.52 v2(60.47,70.47)
PA0: length 31.4
  Bottom Layer w0.4: 48.26,5.97 48.26,12.45 42.67,18.03 42.67,31.75 43.56,32.64 H4.14
PA1: length 28.5
  Bottom Layer w0.4: H4.15 44.2,30.1 43.94,29.84 43.94,18.41 50.8,11.56 50.8,5.97
PA2: length 24.8
  Bottom Layer w0.4: H4.16 45.59,18.41 53.34,10.67 53.34,5.97
PA3: length 17.1
  Bottom Layer w0.5: 55.88,5.97 55.88,10.29 48.26,17.91 H5.1
PA4: length 15
  Bottom Layer w0.5: 58.42,5.97 58.42,10.79 55.88,13.33 H5.4
PA5: length 15
  Bottom Layer w0.5: H5.5 58.42,13.46 60.96,10.92 60.96,5.97
PA6: length 15
  Bottom Layer w0.5: 63.5,5.97 63.5,10.79 60.96,13.33 H5.6
PA7: length 15
  Bottom Layer w0.5: H5.7 63.5,13.46 66.04,10.92 66.04,5.97
PA8: length 63.4
  Bottom Layer w0.4: H10.9 75.31,89.53 81.15,89.53 96.39,74.29 96.39,50.04 94.24,47.88 91.44,47.88
PA9: length 62.2
  Bottom Layer w0.4: H10.10 68.58,93.67 73.6,88.65 81.03,88.65 95.63,74.04 95.63,51.94 94.11,50.42 91.44,50.42
PA10: length 60.6
  Bottom Layer w0.4: 91.44,52.96 93.47,52.96 94.74,54.23 94.74,73.79 80.65,87.88 71.5,87.88 66.04,93.34 H10.11
PA11: length 59
  Bottom Layer w0.4: H10.12 63.5,93.22 69.6,87.12 80.26,87.12 93.98,73.41 93.98,56.51 92.96,55.5 91.44,55.5
PA12: length 58.5
  Bottom Layer w0.4: 91.44,58.04 92.8,58.04 93.2,58.44 93.2,73.17 80.01,86.36 66.55,86.36 60.96,91.95 H10.13
PA13/TMS: length 96.5
  Top Layer w0.5: v3(106.55,41.4) 105.92,42.04 105.92,53.21 98.55,60.58 91.44,60.58
  Bottom Layer w0.4: v3(106.55,41.4) 106.66,41.29 113.01,41.29 113.41,40.89 H2.7 ; H10.14 58.42,91.95 64.77,85.6 79.63,85.6 92.46,72.77 92.46,60.98 92.06,60.58 91.44,60.58
PA14/TCK: length 91.5
  Top Layer w0.5: v2(112.65,43.56) 111.51,44.7 111.51,54.61 92.84,73.28 v2(89.15,73.28)
  Bottom Layer w0.4: H11.1 55.88,90.55 61.72,84.71 79.02,84.71 86.36,77.37 H7.1
  Bottom Layer w0.5: v2(89.15,73.28) H7.1
  Bottom Layer w1: H2.9 116.33,43.56 v2(112.65,43.56)
PA15/TDI: length 104.7
  Top Layer w0.5: v2(114.23,38.33) 113.87,37.97 110.63,37.97 109.22,39.38 109.22,54.99 92.96,71.25 v2(89.2,71.25) ; 116.08,37.97 116.46,38.35
  Bottom Layer w0.4: 53.78,93.19 53.78,93.73 H11.2 53.34,89.03 58.42,83.95 76.96,83.95 83.82,77.09 83.82,73.52 84.06,73.28 H7.2
  Bottom Layer w0.5: v2(89.2,71.25) 84.46,71.25 83.82,71.88 H7.2
  Bottom Layer w1: 112.89,37.97 113.87,37.97 v2(114.23,38.33) 116.44,38.33 116.46,38.35
PB0: length 15
  Bottom Layer w0.5: H5.10 71.12,13.72 73.66,11.18 73.66,5.97
PB1: length 15.1
  Bottom Layer w0.4: H9.9 76.33,6.73 76.33,6.1
  Bottom Layer w0.5: H5.11 73.66,13.72 76.33,11.05 76.33,6.73
PB2/BOOT1: length 27.3
  Top Layer w0.5: H9.10 v2(78.74,10.79) R23.1
  Bottom Layer w0.5: H5.12 76.2,13.72 78.74,11.18 v2(78.74,10.79) 78.74,5.97
PB3/TDO: length 119
  Top Layer w0.5: v2(71.22,75.67) 72.52,76.96 102.47,76.96 113.22,66.21 113.22,49.34 114.05,48.51 v4(114.44,48.51) H2.13
  Bottom Layer w0.4: H11.7 40.64,81.15 41.78,80.01 66.8,80.01 71.12,75.69 71.12,75.67
  Bottom Layer w0.5: H7.7 71.22,73.38 v2(71.22,75.67)
  Bottom Layer w1: H2.13 114.16,48.51 114.04,48.64 R17.1
PB4/TRST: length 124.5
  Top Layer w0.5: v2(68.56,70.73) 69.7,69.6 92.33,69.6 107.82,54.1 107.82,38.86 v1(110.75,35.94) 110.93,35.76 113.58,35.76
  Bottom Layer w0.4: H11.8 38.1,81.53 40.39,79.25 65.41,79.25 68.58,76.07 H7.8
  Bottom Layer w0.5: H7.8 68.56,73.26 v2(68.56,70.73)
  Bottom Layer w1: H2.3 116.34,35.94 v1(110.75,35.94)
PB5: length 47.3
  Bottom Layer w0.4: H7.9 66.04,76.07 63.75,78.36 39.5,78.36 35.56,82.3 H11.9
PB6: length 46.6
  Bottom Layer w0.4: H7.10 63.63,73.41 63.63,75.18 61.34,77.47 38.48,77.47 33.02,82.93 H11.10
PB7: length 46.4
  Bottom Layer w0.4: 61.59,73.28 60.96,73.91 60.96,75.31 59.94,76.33 37.59,76.33 30.48,83.44 H11.11
PB8: length 42.7
  Bottom Layer w0.4: H11.12 28.43,93.24 28.43,83.84 36.58,75.69 54.74,75.69 55.88,74.55 H7.13
PB9: length 42.1
  Bottom Layer w0.4: H11.13 26.54,92.58 26.54,84.13 35.48,75.19 52.7,75.19 53.34,74.55 H7.14
PB10: length 15
  Bottom Layer w0.5: 81.28,5.97 81.28,11.56 78.74,14.1 H5.13
PB11: length 15
  Bottom Layer w0.5: 83.82,5.97 83.82,13.21 81.28,15.75 H5.14
PB12: length 79.1
  Bottom Layer w0.4: 91.44,27.56 91.57,27.69 96.65,27.69 103.38,34.42 103.38,81.91 91.57,93.73 H10.1
PB13: length 75.5
  Bottom Layer w0.4: H10.2 102.49,80.14 102.49,38.35 94.23,30.1 91.44,30.1
PB14: length 73.1
  Bottom Layer w0.4: 91.44,32.64 91.62,32.46 93.55,32.46 101.6,40.51 101.6,78.49 H10.3
PB15: length 71.3
  Bottom Layer w0.4: H10.4 83.82,93.6 100.71,76.71 100.71,41.15 94.87,35.31 91.57,35.31 91.44,35.18
PC0: length 48
  Bottom Layer w0.4: H4.8 41.15,47.88 37.59,44.32 37.59,13.59 38.1,13.08 38.1,5.97
PC1: length 44.4
  Bottom Layer w0.4: H4.9 42.93,45.34 38.99,41.4 38.99,14.73 40.64,13.08 40.64,5.97
PC2: length 42
  Bottom Layer w0.4: H4.10 42.54,42.8 40.26,40.51 40.26,16 43.18,13.08 43.18,5.97
PC3: length 39.4
  Bottom Layer w0.4: 45.85,6.73 45.85,6.1 ; 45.85,6.73 45.85,13.21 41.53,17.53 41.53,38.86 42.93,40.26 H4.11 ; 45.85,6.73 H8.9
PC4: length 15
  Bottom Layer w0.5: 68.58,5.97 68.58,11.43 66.04,13.97 H5.8
PC5: length 15
  Bottom Layer w0.5: H5.9 68.58,13.72 71.12,11.18 71.12,5.97
PC6: length 69.2
  Bottom Layer w0.4: 91.44,37.72 94.74,37.72 99.82,42.8 99.82,75.31 81.41,93.73 H10.5
PC7: length 67.8
  Bottom Layer w0.4: H10.6 78.87,93.73 80.77,91.82 82.17,91.82 98.93,75.06 98.93,44.33 95.12,40.51 91.69,40.51 91.44,40.26
PC8: length 66.4
  Bottom Layer w0.4: 76.2,93.22 76.57,93.22 78.74,91.06 81.79,91.06 98.04,74.8 98.04,45.59 95.25,42.8 91.44,42.8
PC9: length 65.8
  Bottom Layer w0.4: 91.44,45.34 91.69,45.34 91.87,45.16 95.56,45.16 97.28,46.89 97.28,74.42 81.41,90.3 77.09,90.3 H10.8
PC10: length 44.4
  Bottom Layer w0.4: H11.3 50.8,87.25 54.86,83.18 74.17,83.18 81.28,76.07 H7.3
PC11: length 46.6
  Bottom Layer w0.4: H7.4 78.74,75.31 71.74,82.31 48.66,82.31 48.26,82.71 H11.4
PC12: length 47.4
  Bottom Layer w0.4: H7.5 76.33,73.41 76.33,75.69 70.47,81.55 46.12,81.55 45.72,81.95 H11.5
PC13: length 65.9
  Bottom Layer w0.4: H4.2 43.18,63.12 27.94,47.88 27.94,5.97
PC14: length 62.1
  Bottom Layer w0.4: H4.3 43.43,60.58 30.48,47.62 30.48,5.97
PC15: length 58.4
  Bottom Layer w0.4: 33.27,6.86 33.27,6.22 ; 33.27,6.86 H8.4 ; 33.27,6.86 33.27,47.62 43.69,58.04 H4.4
PD2: length 48.5
  Bottom Layer w0.4: H11.6 42.42,92.96 42.42,81.53 43.18,80.77 68.2,80.77 73.79,75.18 73.79,73.41 H7.6
RST: length 153.8
  Top Layer w0.4: v3(86.74,27.43) 87.63,27.43 89.28,25.78 96.77,25.78 99.49,28.5 99.49,46.03 v3(104.52,51.05)
  Top Layer w0.5: v3(55.75,42.54) 70.87,27.43 v3(77.47,27.43)
  Bottom Layer w0.4: 35.56,5.97 35.56,46.1 39.88,50.42 H4.7 47.88,50.42 v3(55.75,42.54)
  Bottom Layer w0.5: v3(77.47,27.43) v3(86.74,27.43)
  Bottom Layer w1: v3(104.52,51.05) H2.15
$1N1019: length 17
  Bottom Layer w0.6: H4.5 48.01,55.5 51.03,58.53 X1.2 57.99,58.53 C1.1 58.35,55.43 R1.2
$1N1024: length 18.4
  Bottom Layer w0.6: R1.1 58.46,53.81 C2.1 54.09,50.05 X1.1 53.23,49.66 50.67,49.66 47.37,52.96 H4.6
$2N251: length 10.1
  Top Layer w1: R2.2 11.3,14.9 Q1.1 7.64,21.44 D1.2
$2N756: length 16
  Top Layer w0.5: U1.1 5.45,41.91 6.27,42.74 ; D2.1 10.54,44.69 10.54,42.74 6.27,42.74 ; 6.27,42.74 6.27,45.8 5.54,45.8 L1.2
$2N758: length 4.3
  Top Layer w0.5: R10.2 3.04,39.5 R7.2 3.29,37.59 U1.2
$2N759: length 4.8
  Top Layer w0.5: U1.6 12.19,36.32 13.07,35.44 R8.2
$2N760: length 2.6
  Top Layer w0.5: C7.1 3.24,36.32 U1.3
$2N761: length 2.2
  Top Layer w0.5: C7.2 1.59,33.98 R9.2
$2N764: length 3.5
  Top Layer w0.8: LED1.2 13.46,9.1 R11.1
$2N765: length 4.7
  Top Layer w0.5: R12.1 5.62,32.25 ; 5.62,32.25 6.73,32.25 R13.2 ; 5.62,32.25 5.62,34.87 U1.4
$2N766: length 2.6
  Top Layer w0.5: 10.54,41.34 10.81,41.07 U1.8
$3N561: length 2.7
  Top Layer w0.5: 88.89,1.4 88.9,1.41 BOOT0.2
$3N565: length 4.4
  Top Layer w0.5: v1(88.9,9.14) 88.9,10.28 R23.2
  Bottom Layer w0.5: BOOT1.2 v1(88.9,9.14)

## Copper pours and planes (outline as drawn; the poured copper is in the pictures)
+3V3 on Top Layer: 3.17,58.04 19.18,58.04 19.18,49.04 3.17,49.04
+3V3 on Bottom Layer: 7.37,56.65 19.3,56.65 19.3,50.8 7.37,50.8
GND on Top Layer: 6.86,38.37 11.94,38.37 11.94,30.1 6.86,30.1
GND on Top Layer: 0.25,34.8 3.94,34.8 3.94,29.14 0.25,29.14
GND on Top Layer: 12.74,50.8 20.99,50.8 20.99,41.03 12.74,41.03
GND on Bottom Layer: 0.38,40.26 17.87,40.26 17.87,29.08 0.38,29.08
GND on Bottom Layer: 0.25,50.93 17.91,50.93 17.91,36.96 0.25,36.96
$2N756 on Top Layer: 3.05,47.37 11.68,47.37 11.68,42.1 3.05,42.1
